# EAGLE schematic AppleMouse_old (EAGLE 7.6.0)
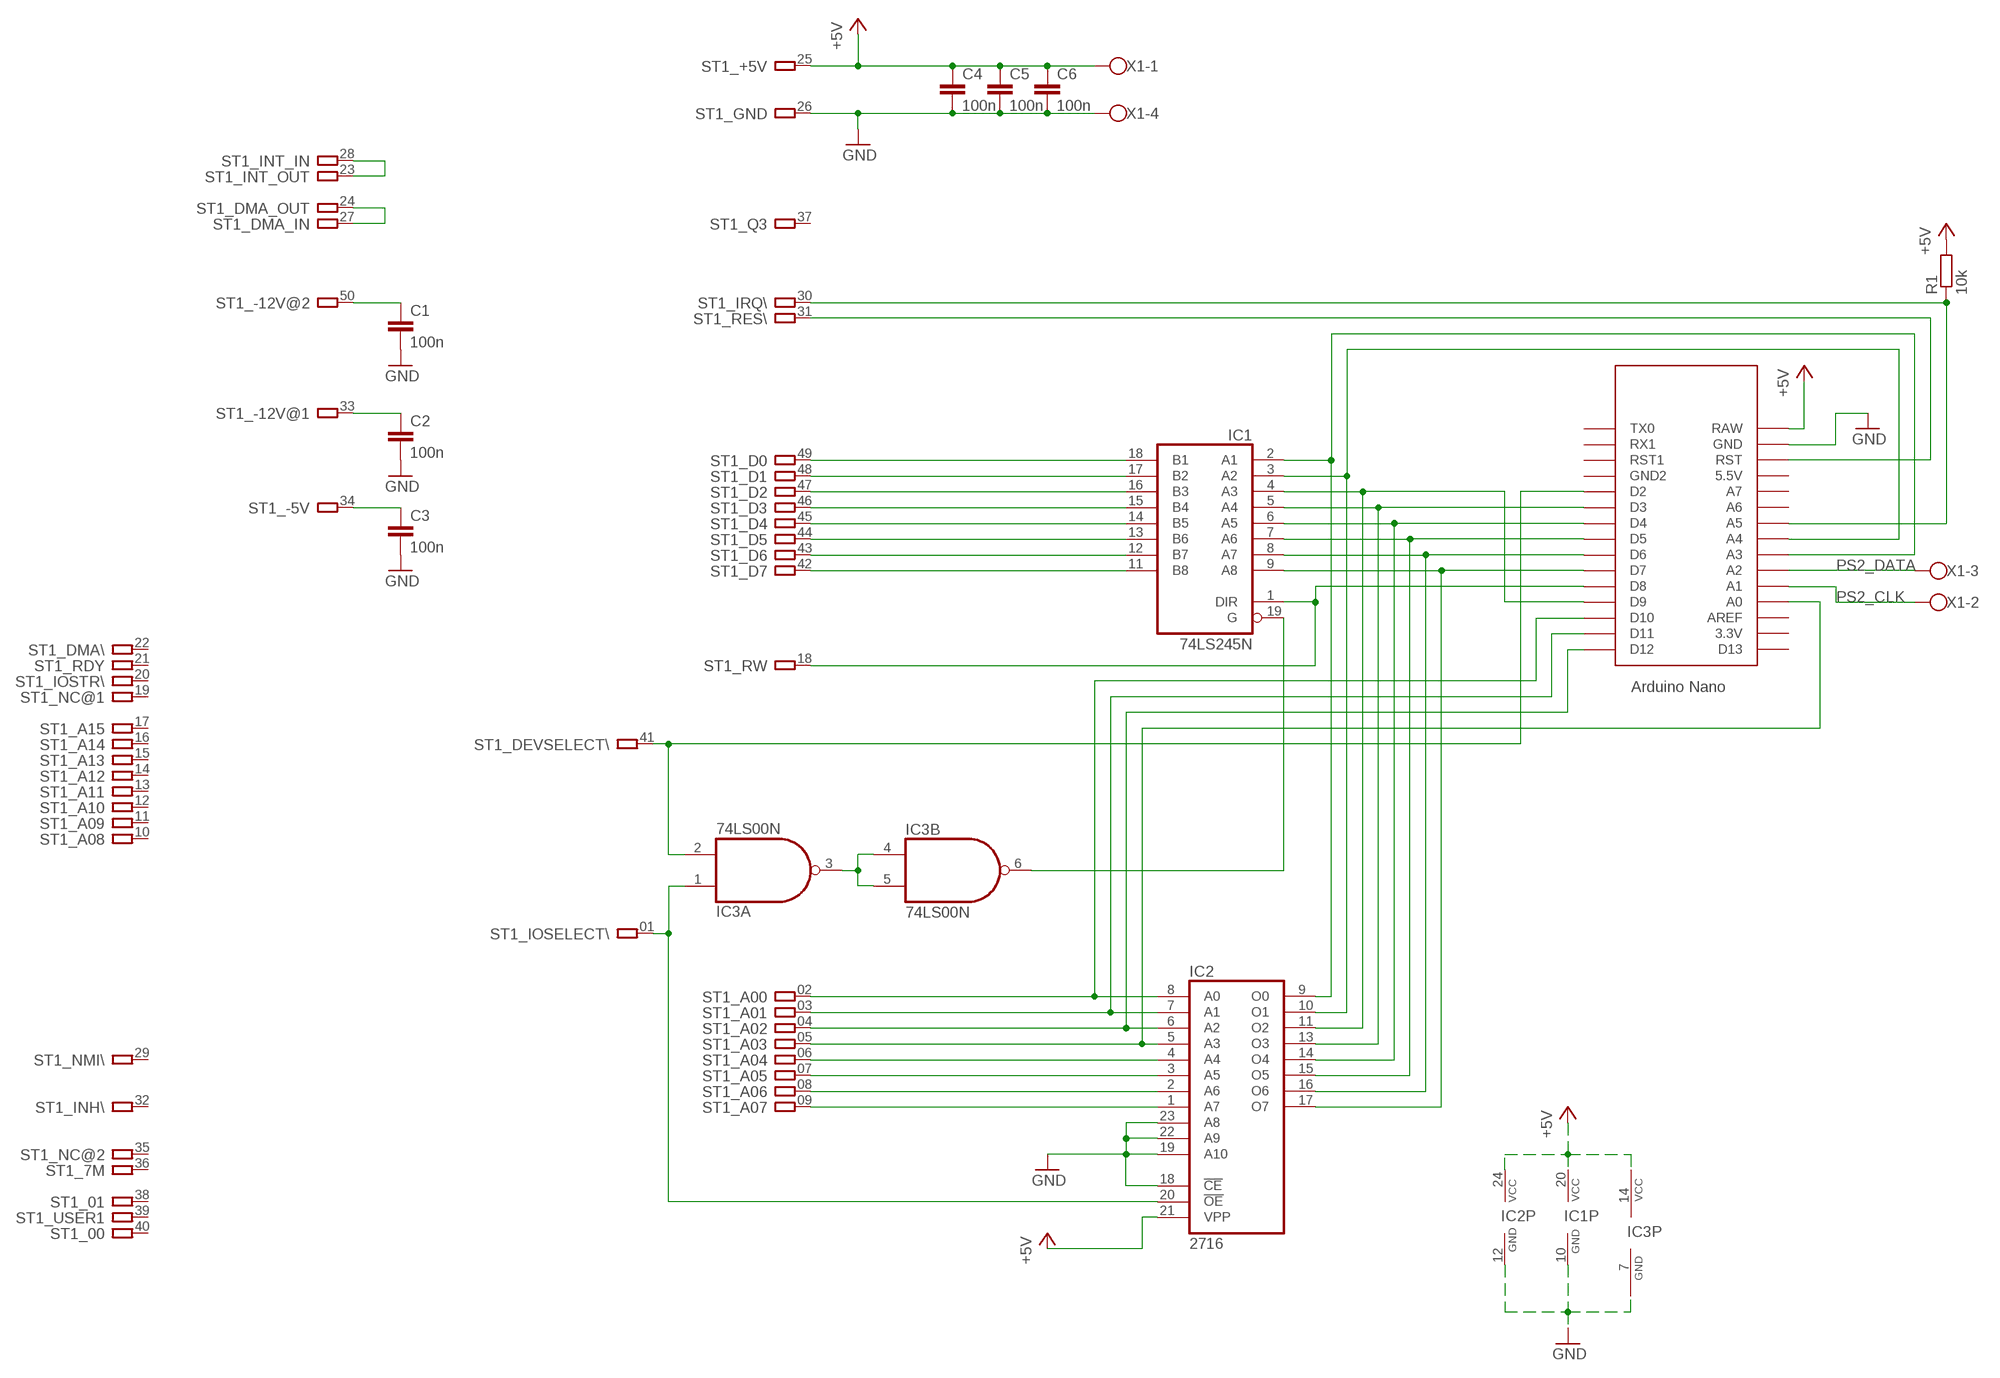
[diagram p0: schematic, sheet 1]

## Parts
C1  100n  C-EU025-030X050  [C025-030X050]
C2  100n  C-EU025-030X050  [C025-030X050]
C3  100n  C-EU025-030X050  [C025-030X050]
C4  100n  C-EU025-030X050  [C025-030X050]
C5  100n  C-EU025-030X050  [C025-030X050]
C6  100n  C-EU025-030X050  [C025-030X050]
IC1  74LS245N  [DIL20]
IC2  2716  [DIL24]
IC3  74LS00N  [DIL14]
R1  10k  R-EU_0204/7  [0204/7]
ST1  A2-50PINSLOT1-3  [A2-50PIN-SL1-3]
U$1  NANO  [NANO]
X1  W237-4  [W237-4]

## Nets
+5V: C4.1 C5.1 C6.1 IC1.20(VCC) IC2.21(VPP) IC2.24(VCC) IC3.14(P:VCC) R1.2 ST1.25 U$1.RAW X1.1
GND: C1.2 C2.2 C3.2 C4.2 C5.2 C6.2 IC1.10(GND) IC2.12(GND) IC2.18(!CE) IC2.19(A10) IC2.22(A9) IC2.23(A8) IC3.7(P:GND) ST1.26 U$1.GND X1.4
N$1: IC1.18(B1) ST1.49
N$2: IC1.17(B2) ST1.48
N$3: IC1.16(B3) ST1.47
N$4: IC1.15(B4) ST1.46
N$5: IC1.14(B5) ST1.45
N$6: IC1.13(B6) ST1.44
N$7: IC1.12(B7) ST1.43
N$8: IC1.11(B8) ST1.42
N$9: IC1.2(A1) IC2.9(O0) U$1.A3
N$10: IC1.3(A2) IC2.10(O1) U$1.A4
N$11: IC1.4(A3) IC2.11(O2) U$1.D9
N$12: IC1.5(A4) IC2.13(O3) U$1.D3
N$13: IC1.9(A8) IC2.17(O7) U$1.D7
N$14: IC1.7(A6) IC2.15(O5) U$1.D5
N$15: IC1.8(A7) IC2.16(O6) U$1.D6
N$16: R1.1 ST1.30 U$1.A5
N$17: IC1.19(G) IC3.6(B:O)
N$18: IC3.3(A:O) IC3.4(B:I0) IC3.5(B:I1)
N$19: IC2.20(!OE) IC3.1(A:I0) ST1.01
N$20: IC2.8(A0) ST1.02 U$1.D10
N$21: IC2.7(A1) ST1.03 U$1.D11
N$22: IC2.6(A2) ST1.04 U$1.D12
N$23: IC2.5(A3) ST1.05 U$1.A0
N$24: IC2.4(A4) ST1.06
N$25: IC2.3(A5) ST1.07
N$26: IC2.2(A6) ST1.08
N$27: IC2.1(A7) ST1.09
N$28: IC1.1(DIR) ST1.18 U$1.D8
N$29: C1.1 ST1.50
N$30: C2.1 ST1.33
N$31: ST1.24 ST1.27
N$32: ST1.23 ST1.28
N$33: C3.1 ST1.34
N$35: ST1.31 U$1.RST
N$37: IC3.2(A:I1) ST1.41 U$1.D2
N$39: IC1.6(A5) IC2.14(O4) U$1.D4
PS2_CLK: U$1.A1 X1.2
PS2_DATA: U$1.A2 X1.3
Unconnected: IC3.8(C:O) IC3.9(C:I0) IC3.10(C:I1) IC3.11(D:O) IC3.12(D:I0) IC3.13(D:I1) ST1.10 ST1.11 ST1.12 ST1.13 ST1.14 ST1.15 ST1.16 ST1.17 ST1.19 ST1.20 ST1.21 ST1.22 ST1.29 ST1.32 ST1.35 ST1.36 ST1.37 ST1.38 ST1.39 ST1.40 U$1.3.3V U$1.5V(5.5V) U$1.A6 U$1.A7 U$1.AREF U$1.D13 U$1.GND1(GND2) U$1.ICSP1 U$1.ICSP2 U$1.ICSP3 U$1.ICSP4 U$1.ICSP5 U$1.ICSP6 U$1.RST1 U$1.RX1 U$1.TX0

## Library data of the parts
C1-C6 = rcl:C-EU: CAPACITOR, European symbol
IC1 = 74xx-eu:74*245: Octal BUS TRANSCEIVER, 3-state
IC2 = memory:2716: MEMORY
IC3 = 74xx-us:74*00: Quad 2-input NAND gate
R1 = rcl:R-EU_: RESISTOR, European symbol
ST1 = con-apple2:A2-50PIN: Apple ][ Peripheral Card Connector This is the, default, 50-pin connector for slot #1 to #7 Pins are laid out as seen from the top of the slot
U$1 = Arduino-clone:NANO: Arduino Nano
X1 = con-wago-500:W237-4: WAGO SCREW CLAMP; OC_FARNELL: unknown; OC_NEWARK: unknown